# Altium schematic sheet Sheet1.SchDoc
size A3
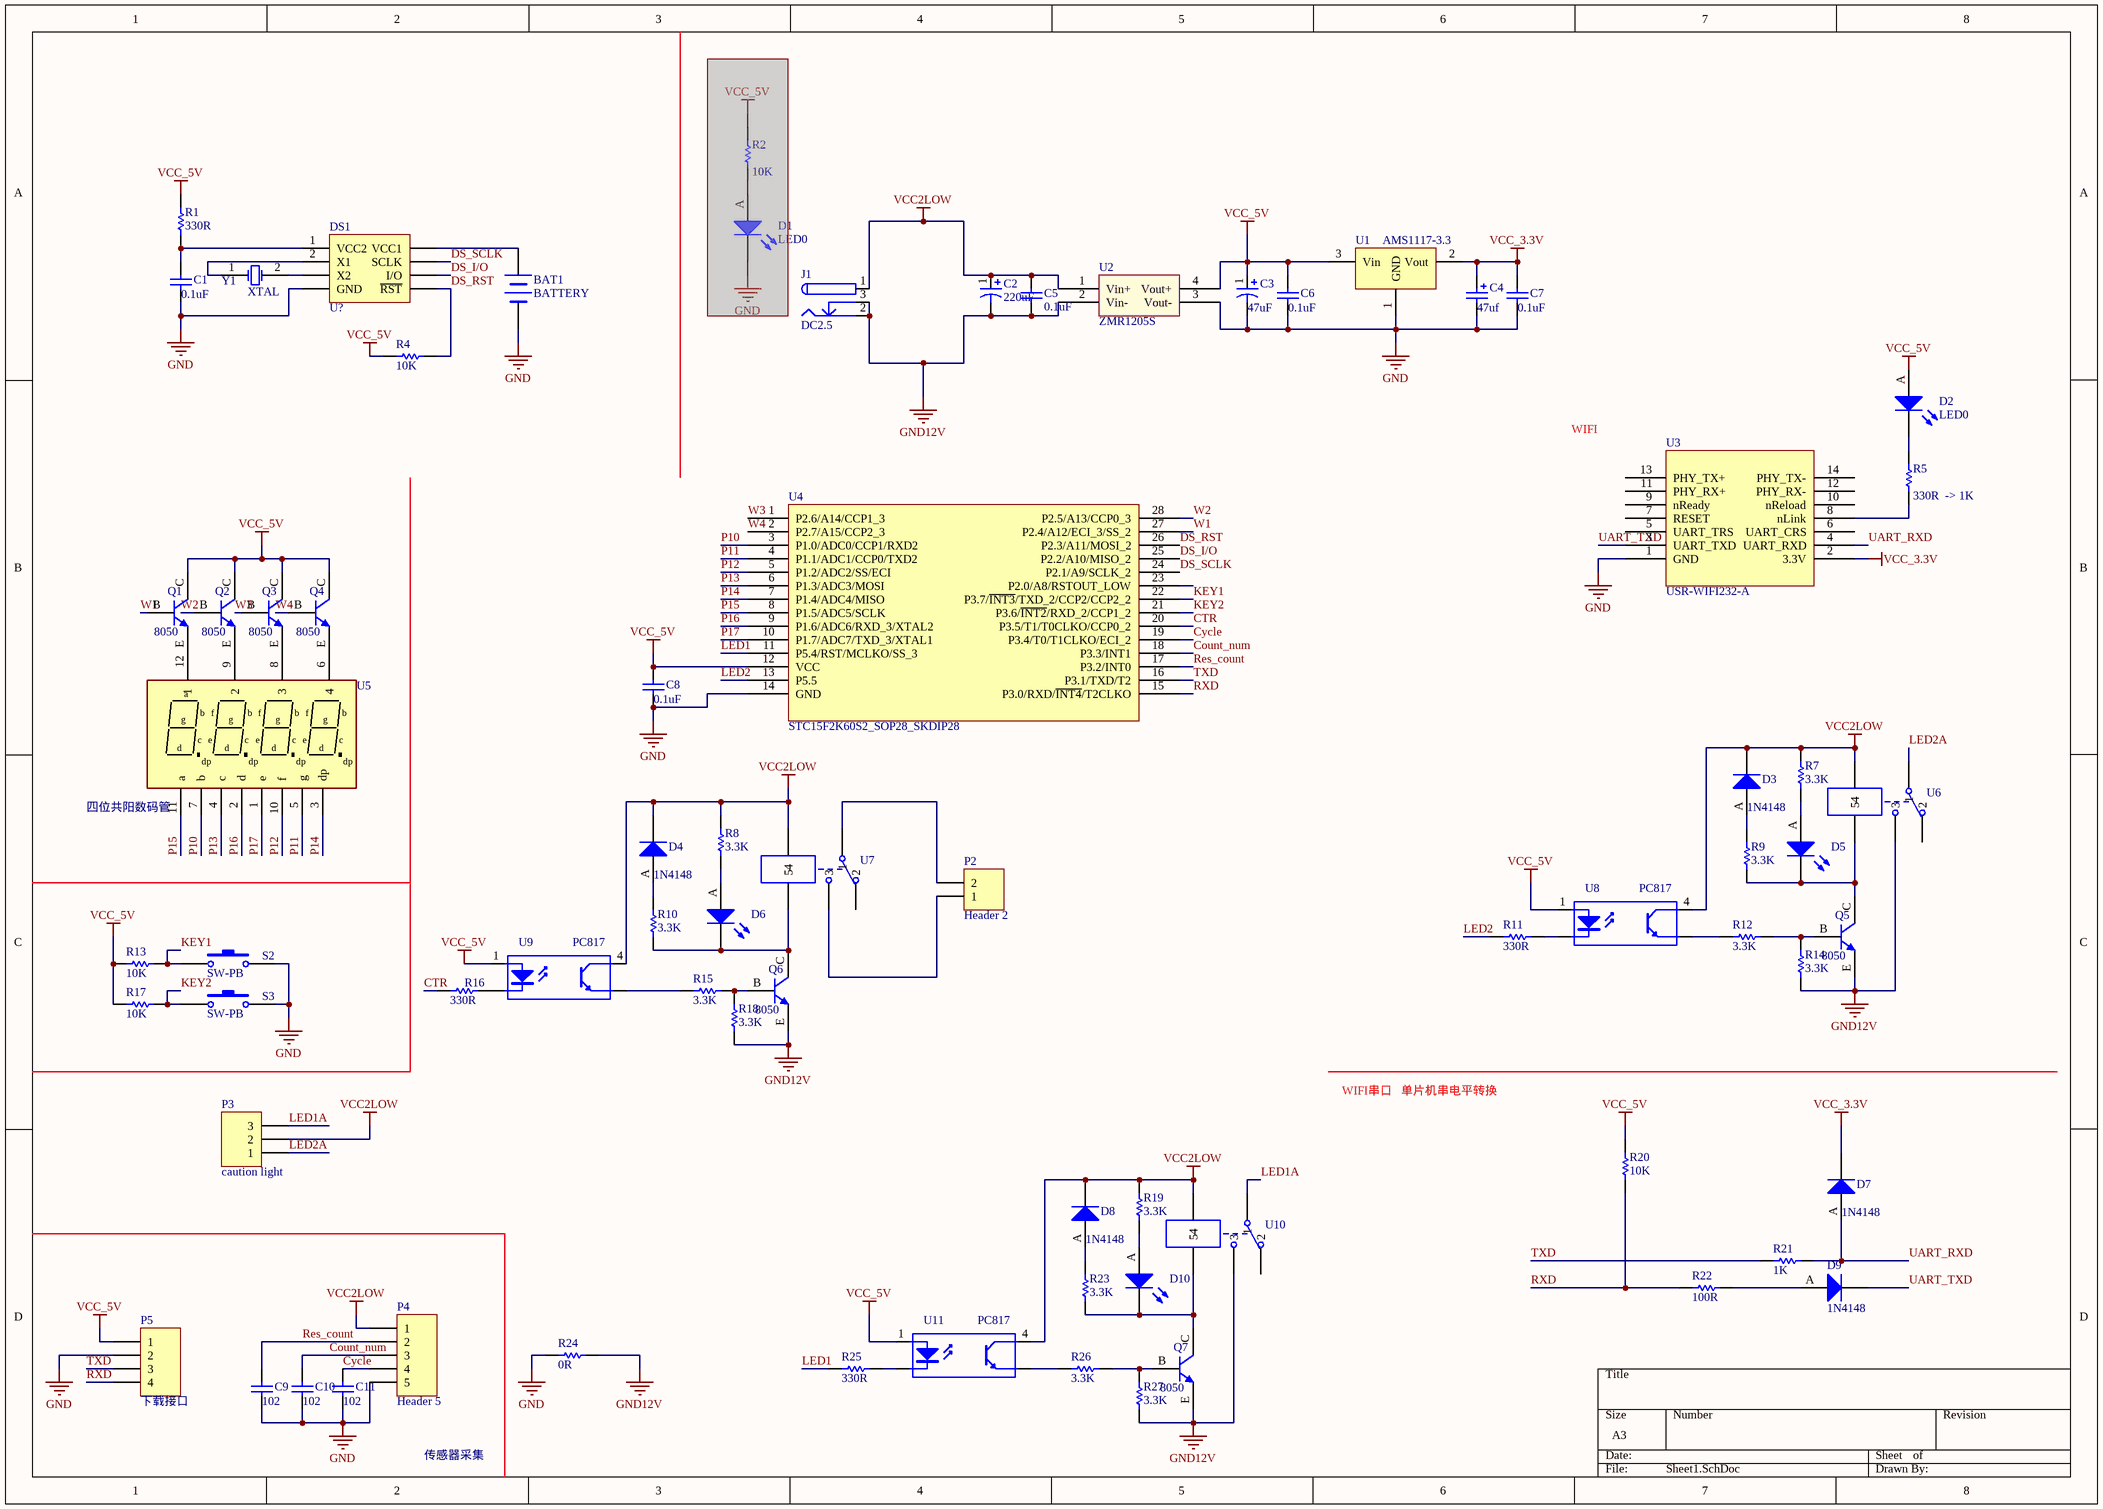
[diagram p0: Sheet1.SchDoc]

## Parts
BAT1  BATTERY  [BATTERY]
C1  0.1uF  [0805C]
C2  220uF  [铝电解电容6x7]
C3  value 47uF  [铝电解电容6x7]  (hidden comment: 220uF)
C4  value 47uf  [CAP 3216X06M]  (hidden comment: Cap Tantalum)
C5  value 0.1uF  [0805C]  (hidden comment: Cap1)
C6  0.1uF  [0805C]
C7  0.1uF  [0805C]
C8  0.1uF  [0805C]
C9  value 102  [0805C]  (hidden comment: 0.1uF)
C10  value 102  [0805C]  (hidden comment: 0.1uF)
C11  value 102  [0805C]  (hidden comment: 0.1uF)
D1  LED0  [led-5mm]  (masked out: inside a compile mask, not in the netlist)
D2  LED0  [0805AK]
D3  1N4148  [二极管贴片]
D4  1N4148  [二极管贴片]
D5  GREEN  [0805AK]  (value not drawn)
D6  GREEN  [0805AK]  (value not drawn)
D7  1N4148  [二极管贴片]
D8  1N4148  [二极管贴片]
D9  1N4148  [二极管贴片]
D10  GREEN  [0805AK]  (value not drawn)
DS1  U?  [SOP-8]
J1  DC2.5  [POW]
P2  Header 2  [5.08_2P]
P3  caution light  [5.08_3P]
P4  Header 5  [5.08_5P]
P5  下载接口  [HDR1X4]
Q1  8050  [SOT-23-EBC]
Q2  8050  [SOT-23-EBC]
Q3  8050  [SOT-23-EBC]
Q4  8050  [SOT-23-EBC]
Q5  8050  [SOT-23-EBC]
Q6  8050  [SOT-23-EBC]
Q7  8050  [SOT-23-EBC]
R1  value 330R  [0805R]  (hidden comment: Res Semi)
R2  value 10K  [0805R]  (hidden comment: Res Semi)  (masked out: inside a compile mask, not in the netlist)
R4  value 10K  [0805R]  (hidden comment: Res Semi)
R5  value 330R  -> 1K  [0805R]  (hidden comment: Res1)
R7  value 3.3K  [0805R]  (hidden comment: Res Semi)
R8  value 3.3K  [0805R]  (hidden comment: Res Semi)
R9  value 3.3K  [0805R]  (hidden comment: Res Semi)
R10  value 3.3K  [0805R]  (hidden comment: Res Semi)
R11  value 330R  [0805R]  (hidden comment: Res Semi)
R12  value 3.3K  [0805R]  (hidden comment: Res Semi)
R13  value 10K  [0805R]  (hidden comment: Res Semi)
R14  value 3.3K  [0805R]  (hidden comment: Res Semi)
R15  value 3.3K  [0805R]  (hidden comment: Res Semi)
R16  value 330R  [0805R]  (hidden comment: Res Semi)
R17  value 10K  [0805R]  (hidden comment: Res Semi)
R18  value 3.3K  [0805R]  (hidden comment: Res Semi)
R19  value 3.3K  [0805R]  (hidden comment: Res Semi)
R20  value 10K  [0805R]  (hidden comment: Res Semi)
R21  value 1K  [0805R]  (hidden comment: Res Semi)
R22  value 100R  [0805R]  (hidden comment: Res Semi)
R23  value 3.3K  [0805R]  (hidden comment: Res Semi)
R24  value 0R  [0805R]  (hidden comment: Res Semi)
R25  value 330R  [0805R]  (hidden comment: Res Semi)
R26  value 3.3K  [0805R]  (hidden comment: Res Semi)
R27  value 3.3K  [0805R]  (hidden comment: Res Semi)
S2  SW-PB  [KEY—立式]
S3  SW-PB  [KEY—立式]
U1  AMS1117-3.3  [AMS1117]
U2  ZMR1205S  [ZMR2405S]
U3  USR-WIFI232-A  [USR-WIFI232-A/B/D]
U4  STC15F2K60S2_SOP28_SKDIP28  [SOP28-STC]
U5  四位共阳数码管  [0.4英寸 4位共阳数码管]
U6  HK4100F-DCXV-SHG  [HK4100F-DC5V-SHG]  (value not drawn)
U7  HK4100F-DCXV-SHG  [HK4100F-DC5V-SHG]  (value not drawn)
U8  PC817  [PC817]
U9  PC817  [PC817]
U10  HK4100F-DCXV-SHG  [HK4100F-DC5V-SHG]  (value not drawn)
U11  PC817  [PC817]
Y1  XTAL  [NX5032CA]

## Nets
GND: BAT1.2(-) C1.1 C3.2 C4.2 C6.1 C7.1 C8.1 C9.1 C10.1 C11.1 DS1.4(GND) P4.5 P5.2 R24.1 S2.1 S3.1 U1.1(GND) U2.3(Vout-) U3.1(GND) U4.14(GND)
GND12V: C2.2 C5.2 J1.2 J1.3 Q5.E Q6.E Q7.E R14.1 R18.1 R24.2 R27.1 U2.2(Vin-) U6.3 U10.3
VCC2LOW: C2.1 C5.1 D3.K D4.K D8.K J1.1 P3.2 P4.1 R7.1 R8.2 R19.1 U2.1(Vin+) U6.4 U7.4 U8.4(C) U9.4(C) U10.4 U11.4(C)
VCC_3.3V: C4.1 C7.2 D7.K U1.2(Vout) U3.2(3.3V)
VCC_5V: C3.1 C6.2 C8.2 D2.A P5.1 Q1.C Q2.C Q3.C Q4.C R1.2 R4.1 R13.2 R17.2 R20.1 U1.3(Vin) U2.4(Vout+) U4.12(VCC) U8.1(A) U9.1(A) U11.1(A)
Count_num: C10.2 P4.3 U4.18(P3.3/INT1)
CTR: R16.2 U4.20(P3.5/T1/T0CLKO/CCP0_2)
Cycle: C11.2 P4.4 U4.19(P3.4/T0/T1CLKO/ECI_2)
DS_I/O: DS1.6(I/O) U4.25(P2.2/A10/MISO_2)
DS_RST: DS1.5(~{RST}) R4.2 U4.26(P2.3/A11/MOSI_2)
DS_SCLK: DS1.7(SCLK) U4.24(P2.1/A9/SCLK_2)
KEY1: R13.1 S2.2 U4.22(P3.7/~{INT3}/TXD_2/CCP2/CCP2_2)
KEY2: R17.1 S3.2 U4.21(P3.6/~{INT2}/RXD_2/CCP1_2)
LED1: R25.1 U4.11(P5.4/RST/MCLKO/SS_3)
LED1A: P3.3 U10.1
LED2: R11.1 U4.13(P5.5)
LED2A: P3.1 U6.1
P10: U4.3(P1.0/ADC0/CCP1/RXD2) U5.7(b)
P11: U4.4(P1.1/ADC1/CCP0/TXD2) U5.5(g)
P12: U4.5(P1.2/ADC2/SS/ECI) U5.10(f)
P13: U4.6(P1.3/ADC3/MOSI) U5.4(c)
P14: U4.7(P1.4/ADC4/MISO) U5.3(dp)
P15: U4.8(P1.5/ADC5/SCLK) U5.11(a)
P16: U4.9(P1.6/ADC6/RXD_3/XTAL2) U5.2(d)
P17: U4.10(P1.7/ADC7/TXD_3/XTAL1) U5.1(e)
Res_count: C9.2 P4.2 U4.17(P3.2/INT0)
RXD: P5.4 R20.2 R22.1 U4.15(P3.0/RXD/~{INT4}/T2CLKO)
TXD: P5.3 R21.1 U4.16(P3.1/TXD/T2)
UART_RXD: D7.A R21.2 U3.4(UART_RXD)
UART_TXD: D9.K U3.3(UART_TXD)
W1: Q1.B U4.27(P2.4/A12/ECI_3/SS_2)
W2: Q2.B U4.28(P2.5/A13/CCP0_3)
W3: Q3.B U4.1(P2.6/A14/CCP1_3)
W4: Q4.B U4.2(P2.7/A15/CCP2_3)
NetBAT1_1: BAT1.1(+) DS1.8(VCC1)
NetC1_2: C1.2 DS1.1(VCC2) R1.1
NetD2_K: D2.K R5.2
NetD3_A: D3.A R9.1
NetD4_A: D4.A R10.2
NetD5_A: D5.A R7.2
NetD5_K: D5.K Q5.C R9.2 U6.5
NetD6_A: D6.A R8.1
NetD6_K: D6.K Q6.C R10.1 U7.5
NetD8_A: D8.A R23.1
NetD9_A: D9.A R22.2
NetD10_A: D10.A R19.2
NetD10_K: D10.K Q7.C R23.2 U10.5
NetDS1_2: DS1.2(X1) Y1.1(OSC1)
NetDS1_3: DS1.3(X2) Y1.2(OSC2)
NetP2_1: P2.1 U7.3
NetP2_2: P2.2 U7.1
NetQ1_E: Q1.E U5.12(1)
NetQ2_E: Q2.E U5.9(2)
NetQ3_E: Q3.E U5.8(3)
NetQ4_E: Q4.E U5.6(4)
NetQ5_B: Q5.B R12.2 R14.2
NetQ6_B: Q6.B R15.1 R18.2
NetQ7_B: Q7.B R26.2 R27.2
NetR5_1: R5.1 U3.8(nLink)
NetR11_2: R11.2 U8.2(K)
NetR12_1: R12.1 U8.3(E)
NetR15_2: R15.2 U9.3(E)
NetR16_1: R16.1 U9.2(K)
NetR25_2: R25.2 U11.2(K)
NetR26_1: R26.1 U11.3(E)

Not connected (* = marked no-connect by the designer): U3 5(UART_TRS) 6(UART_CRS) 7(RESET) 9(nReady) 10(nReload) 11(PHY_RX+) 12(PHY_RX-) 13(PHY_TX+) 14(PHY_TX-); U4 23(P2.0/A8/RSTOUT_LOW); U6 2; U7 2; U10 2

## Notes on the sheet
- WIFI
- WIFI串口   单片机串电平转换
- 传感器采集

## Library data of the parts
C1 C6-C11 = Cap: Capacitor; Published: 8-Jun-2000; LatestRevisionDate: 17-Jul-2002; LatestRevisionNote: Re-released for DXP Platform.; PackageReference: RAD-0.3; Publisher: Altium Limited
  C1 C6-C8: Value: 0.1uF
C2 C3 = Cap Pol3: Polarized Capacitor (Surface Mount); Published: 8-Jun-2000; LatestRevisionDate: 17-Jul-2002; LatestRevisionNote: Re-released for DXP Platform.; PackageReference: C0805; Publisher: Altium Limited
  C2: Value: 220uF
C4 = Cap Tantalum: 有极性贴片电容; Published: 8-Jun-2000; LatestRevisionDate: 17-Jul-2002; LatestRevisionNote: Re-released for DXP Platform.; PackageReference: RB7.6-15; Publisher: Altium Limited; PackageDescription: Polarized Capacitor (Radial); 2 Leads
C5 = Cap1: 贴片电容; Published: 8-Jun-2000; LatestRevisionDate: 17-Jul-2002; LatestRevisionNote: Re-released for DXP Platform.; PackageReference: RAD-0.3; Publisher: Altium Limited
D1 D2 D5 D6 D10 = LED0: Typical INFRARED GaAs LED; Published: 8-Jun-2000; LatestRevisionDate: 08-Jul-2005; LatestRevisionNote: Mech Layer 1 removed.; PackageReference: LED-0; Publisher: Altium Limited
D3 D4 D7-D9 = Diode 1N4148: High Conductance Fast Diode; Published: 8-Jun-2000; LatestRevisionDate: 17-Jul-2002; LatestRevisionNote: Re-released for DXP Platform.; DatasheetDocument: 1997; PackageReference: DO-35; Publisher: Altium Limited; Code_JEDEC: DO-204-AH; ComponentLink1Description: Manufacturer Link; ComponentLink1URL: http://www.fairchildsemi.com/; ComponentLink2Description: Datasheet; ComponentLink2URL: http://www.fairchildsemi.com/ds/1N%2F1N4148.pdf
DS1 = DS1302
J1 = DC2.5: Low Voltage Power Supply Connector; Published: 17-Dec-2003; DatasheetDocument: 09-May-2002; Publisher: Altium Limited; ComponentLink1Description: Manufacturer Link; ComponentLink1URL: http://domino.kycon.com/internet/Products.html
P2 = Header 2: Header, 2-Pin; LatestRevisionDate: 17-Jul-2002; LatestRevisionNote: Re-released for DXP Platform.; Publisher: Altium Limited
P3 = Header 3: Header, 3-Pin; LatestRevisionDate: 17-Jul-2002; LatestRevisionNote: Re-released for DXP Platform.; Publisher: Altium Limited
P4 = Header 5: Header, 5-Pin; LatestRevisionDate: 17-Jul-2002; LatestRevisionNote: Re-released for DXP Platform.; Publisher: Altium Limited
P5 = Header 4: Header, 4-Pin; LatestRevisionDate: 17-Jul-2002; LatestRevisionNote: Re-released for DXP Platform.; Publisher: Altium Limited
Q1-Q7 = 2N3904: NPN General Purpose Amplifier; Published: 8-Jun-2000; LatestRevisionDate: 15-Jan-2003; LatestRevisionNote: PCB Footprint 'BCY-W3/D4.7' replaced; DatasheetDocument: 1997; PackageDocument: Sep-1998; PackageReference: TO-92A; Publisher: Altium Limited; Code_JEDEC: TO-92A; ComponentLink1Description: Manufacturer Link; ComponentLink1URL: http://www.fairchildsemi.com/; ComponentLink2Description: Datasheet; ComponentLink2URL: http://www.fairchildsemi.com/ds/2N%2F2N3904.pdf
R1 R2 R4 R7-R27 = Res Semi: Semiconductor Resistor; Published: 8-Jun-2000; LatestRevisionDate: 17-Jul-2002; LatestRevisionNote: Re-released for DXP Platform.; PackageReference: AXIAL-0.5; Publisher: Altium Limited
R5 = Res1: 贴片电阻; Published: 8-Jun-2000; LatestRevisionDate: 17-Jul-2002; LatestRevisionNote: Re-released for DXP Platform.; PackageReference: AXIAL-0.3; Publisher: Altium Limited
S2 S3 = SW-PB: Switch; Published: 24-Mar-1999; LatestRevisionDate: 17-Jul-2002; LatestRevisionNote: Re-released for DXP Platform.; PackageReference: SPST-2; Publisher: Altium Limited
U2 = ZMR2405S
U6 U7 U10 = HK4100F-DC5V-SHG
U8 U9 U11 = Optoisolator1: 4-Pin Phototransistor Optocoupler; Published: 24-Mar-1999; LatestRevisionDate: 04-Mar-2005; LatestRevisionNote: Sch pins 3 & 4 Swapped.; DatasheetDocument: Nov-2003; PackageReference: DIP-4; Publisher: Altium Limited
Y1 = XTAL: 晶体振荡器; Published: 8-Jun-2000; LatestRevisionDate: 17-Jul-2002; LatestRevisionNote: Re-released for DXP Platform.; PackageReference: R38; Publisher: Altium Limited